# Altium schematic sheet RA-Manager_Relays.SchDoc
size A4
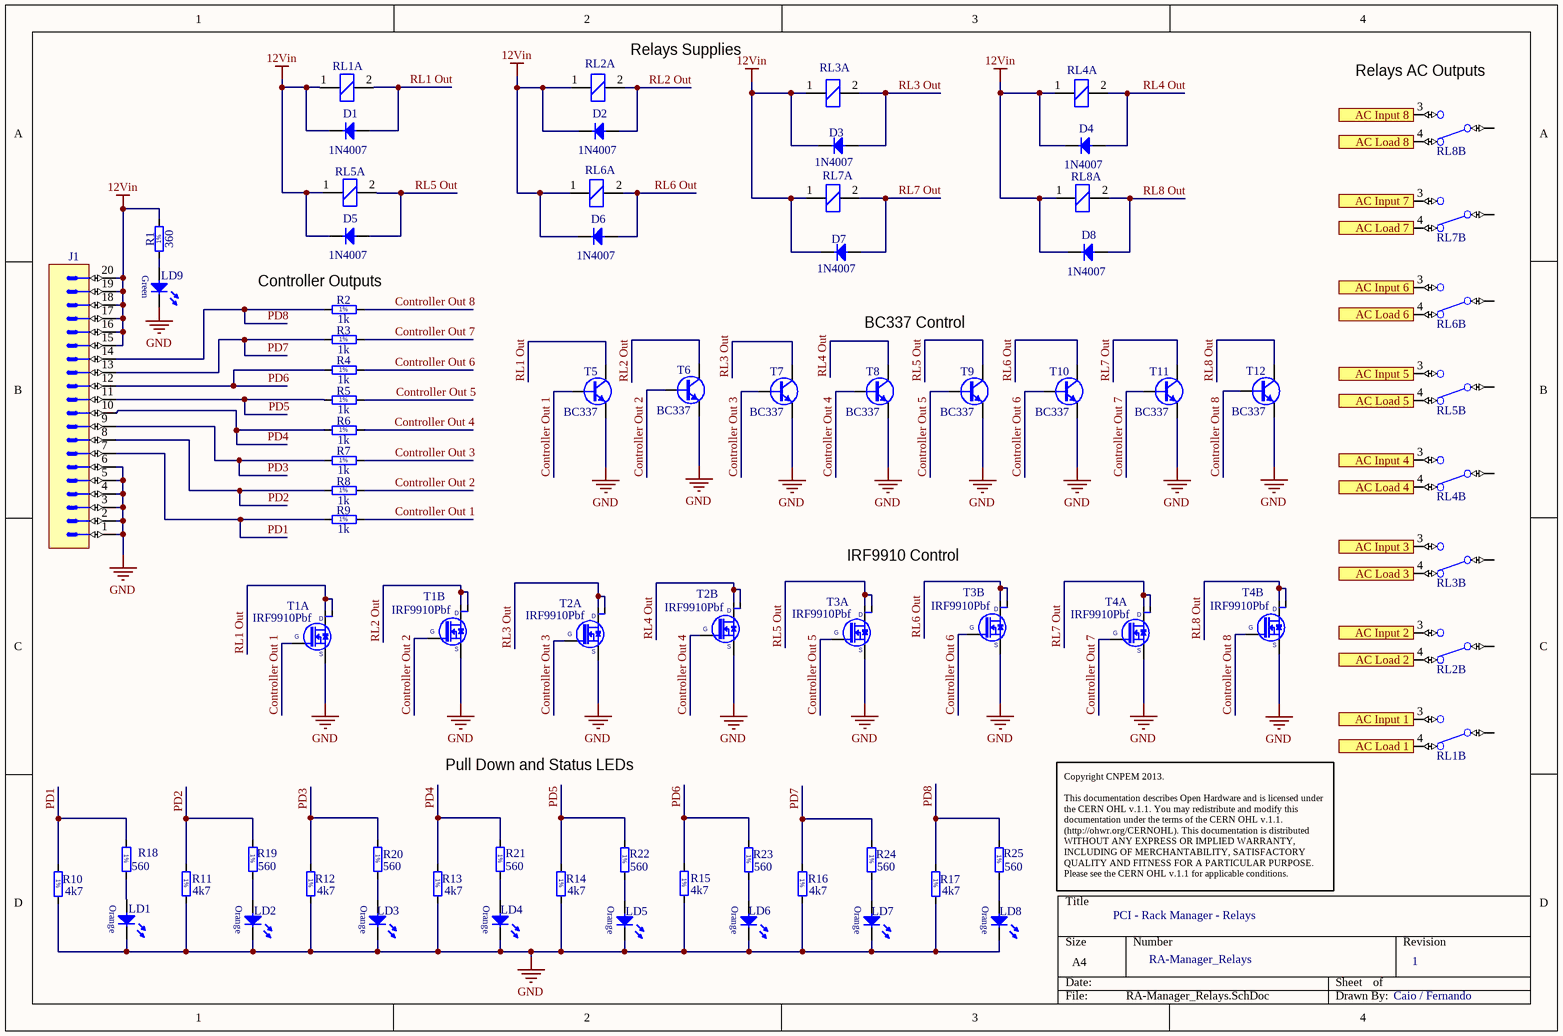
[diagram p0: RA-Manager_Relays.SchDoc]

## Parts
D1  1N4007  [DO-41]
D2  1N4007  [DO-41]
D3  1N4007  [DO-41]
D4  1N4007  [DO-41]
D5  1N4007  [DO-41]
D6  1N4007  [DO-41]
D7  1N4007  [DO-41]
D8  1N4007  [DO-41]
J1  (no value)  [TYCO_2-87224-0]
LD1  Orange  [LED_OSRAM_LGL29K]  (value not drawn)
LD2  Orange  [LED_OSRAM_LGL29K]  (value not drawn)
LD3  Orange  [LED_OSRAM_LGL29K]  (value not drawn)
LD4  Orange  [LED_OSRAM_LGL29K]  (value not drawn)
LD5  Orange  [LED_OSRAM_LGL29K]  (value not drawn)
LD6  Orange  [LED_OSRAM_LGL29K]  (value not drawn)
LD7  Orange  [LED_OSRAM_LGL29K]  (value not drawn)
LD8  Orange  [LED_OSRAM_LGL29K]  (value not drawn)
LD9  Green  [LED_KINGBRIGHT_APA1606_0605]  (value not drawn)
R1  360  [RESC1608X55N]
R2  1k  [RESC1608X55N]
R3  1k  [RESC1608X55N]
R4  1k  [RESC1608X55N]
R5  1k  [RESC1608X55N]
R6  1k  [RESC1608X55N]
R7  1k  [RESC1608X55N]
R8  1k  [RESC1608X55N]
R9  1k  [RESC1608X55N]
R10  4k7  [RESC1608X55N]
R11  4k7  [RESC1608X55N]
R12  4k7  [RESC1608X55N]
R13  4k7  [RESC1608X55N]
R14  4k7  [RESC1608X55N]
R15  4k7  [RESC1608X55N]
R16  4k7  [RESC1608X55N]
R17  4k7  [RESC1608X55N]
R18  560  [RESC1608X55N]
R19  560  [RESC1608X55N]
R20  560  [RESC1608X55N]
R21  560  [RESC1608X55N]
R22  560  [RESC1608X55N]
R23  560  [RESC1608X55N]
R24  560  [RESC1608X55N]
R25  560  [RESC1608X55N]
RL1  12VDC  [REL_YRE_YR-PL2-12]  (value not drawn)  (parts A,B of 2)
RL2  12VDC  [REL_YRE_YR-PL2-12]  (value not drawn)  (parts A,B of 2)
RL3  12VDC  [REL_YRE_YR-PL2-12]  (value not drawn)  (parts A,B of 2)
RL4  12VDC  [REL_YRE_YR-PL2-12]  (value not drawn)  (parts A,B of 2)
RL5  12VDC  [REL_YRE_YR-PL2-12]  (value not drawn)  (parts A,B of 2)
RL6  12VDC  [REL_YRE_YR-PL2-12]  (value not drawn)  (parts A,B of 2)
RL7  12VDC  [REL_YRE_YR-PL2-12]  (value not drawn)  (parts A,B of 2)
RL8  12VDC  [REL_YRE_YR-PL2-12]  (value not drawn)  (parts A,B of 2)
T1  IRF9910Pbf  [SOIC127P600X175-8N]  (parts A,B of 2)
T2  IRF9910Pbf  [SOIC127P600X175-8N]  (parts A,B of 2)
T3  IRF9910Pbf  [SOIC127P600X175-8N]  (parts A,B of 2)
T4  IRF9910Pbf  [SOIC127P600X175-8N]  (parts A,B of 2)
T5  BC337  [TO-92AA-P254]
T6  BC337  [TO-92AA-P254]
T7  BC337  [TO-92AA-P254]
T8  BC337  [TO-92AA-P254]
T9  BC337  [TO-92AA-P254]
T10  BC337  [TO-92AA-P254]
T11  BC337  [TO-92AA-P254]
T12  BC337  [TO-92AA-P254]

## Ports
AC Input 1 (in), AC Input 2 (in), AC Input 3 (in), AC Input 4 (in), AC Input 5 (in), AC Input 6 (in), AC Input 7 (in), AC Input 8 (in), AC Load 1 (out), AC Load 2 (out), AC Load 3 (out), AC Load 4 (out), AC Load 5 (out), AC Load 6 (out), AC Load 7 (out), AC Load 8 (out)

## Nets
12Vin: D1.1(C) D2.1(C) D3.1(C) D4.1(C) D5.1(C) D6.1(C) D7.1(C) D8.1(C) J1.15 J1.16 J1.17 J1.18 J1.19 J1.20 R1.2 RL1.1(COIL) RL2.1(COIL) RL3.1(COIL) RL4.1(COIL) RL5.1(COIL) RL6.1(COIL) RL7.1(COIL) RL8.1(COIL)
GND: J1.1 J1.2 J1.3 J1.4 J1.5 J1.6 LD1.1(C) LD2.1(C) LD3.1(C) LD4.1(C) LD5.1(C) LD6.1(C) LD7.1(C) LD8.1(C) LD9.1(C) R10.2 R11.2 R12.2 R13.2 R14.2 R15.2 R16.2 R17.2 T1.1(S) T1.3(S) T2.1(S) T2.3(S) T3.1(S) T3.3(S) T4.1(S) T4.3(S) T5.3(E) T6.3(E) T7.3(E) T8.3(E) T9.3(E) T10.3(E) T11.3(E) T12.3(E)
AC Input 1: RL1.3(NO) ; port AC Input 1
AC Input 2: RL2.3(NO) ; port AC Input 2
AC Input 3: RL3.3(NO) ; port AC Input 3
AC Input 4: RL4.3(NO) ; port AC Input 4
AC Input 5: RL5.3(NO) ; port AC Input 5
AC Input 6: RL6.3(NO) ; port AC Input 6
AC Input 7: RL7.3(NO) ; port AC Input 7
AC Input 8: RL8.3(NO) ; port AC Input 8
AC Load 1: RL1.4(NC) ; port AC Load 1
AC Load 2: RL2.4(NC) ; port AC Load 2
AC Load 3: RL3.4(NC) ; port AC Load 3
AC Load 4: RL4.4(NC) ; port AC Load 4
AC Load 5: RL5.4(NC) ; port AC Load 5
AC Load 6: RL6.4(NC) ; port AC Load 6
AC Load 7: RL7.4(NC) ; port AC Load 7
AC Load 8: RL8.4(NC) ; port AC Load 8
Controller Out 1: R9.2 T1.4(G) T5.2(B)
Controller Out 2: R8.2 T1.2(G) T6.2(B)
Controller Out 3: R7.2 T2.4(G) T7.2(B)
Controller Out 4: R6.2 T2.2(G) T8.2(B)
Controller Out 5: R5.2 T3.4(G) T9.2(B)
Controller Out 6: R4.2 T3.2(G) T10.2(B)
Controller Out 7: R3.2 T4.4(G) T11.2(B)
Controller Out 8: R2.2 T4.2(G) T12.2(B)
PD1: J1.7 R9.1 R10.1 R18.1
PD2: J1.8 R8.1 R11.1 R19.1
PD3: J1.9 R7.1 R12.1 R20.1
PD4: J1.10 R6.1 R13.1 R21.1
PD5: J1.11 R5.1 R14.1 R22.1
PD6: J1.12 R4.1 R15.1 R23.1
PD7: J1.13 R3.1 R16.1 R24.1
PD8: J1.14 R2.1 R17.1 R25.1
RL1 Out: D1.2(A) RL1.2(COIL) T1.5(D) T1.6(D) T5.1(C)
RL2 Out: D2.2(A) RL2.2(COIL) T1.7(D) T1.8(D) T6.1(C)
RL3 Out: D3.2(A) RL3.2(COIL) T2.5(D) T2.6(D) T7.1(C)
RL4 Out: D4.2(A) RL4.2(COIL) T2.7(D) T2.8(D) T8.1(C)
RL5 Out: D5.2(A) RL5.2(COIL) T3.5(D) T3.6(D) T9.1(C)
RL6 Out: D6.2(A) RL6.2(COIL) T3.7(D) T3.8(D) T10.1(C)
RL7 Out: D7.2(A) RL7.2(COIL) T4.5(D) T4.6(D) T11.1(C)
RL8 Out: D8.2(A) RL8.2(COIL) T4.7(D) T4.8(D) T12.1(C)
NetLD1_2: LD1.2(A) R18.2
NetLD2_2: LD2.2(A) R19.2
NetLD3_2: LD3.2(A) R20.2
NetLD4_2: LD4.2(A) R21.2
NetLD5_2: LD5.2(A) R22.2
NetLD6_2: LD6.2(A) R23.2
NetLD7_2: LD7.2(A) R24.2
NetLD8_2: LD8.2(A) R25.2
NetLD9_2: LD9.2(A) R1.1

Not connected (* = marked no-connect by the designer): RL1 C; RL2 C; RL3 C; RL4 C; RL5 C; RL6 C; RL7 C; RL8 C

## Notes on the sheet
- (near RL2) Relays Supplies
- (near RL8) Relays AC Outputs
- (near R2) Controller Outputs
- BC337 Control
- (near T3) IRF9910 Control
- Pull Down and Status LEDs
- Copyright CNPEM 2013.
  This documentation describes Open Hardware and is licensed under the CERN OHL v.1.1. You may redistribute and modify this documentation under the terms of the CERN OHL v.1.1. (http://ohwr.org/CERNOHL). This documentation is distributed WITHOUT ANY EXPRESS OR IMPLIED WARRANTY, INCLUDING OF MERCHANTABILITY, SATISFACTORY QUALITY AND FITNESS FOR A PARTICULAR PURPOSE. Please see the CERN OHL v.1.1 for applicable conditions.
- PCI - Rack Manager - Relays
- RA-Manager_Relays
- 1
- Caio / Fernando
- (in symbol R0603_1K_1%_0.1W_100PPM) 1%
- (in symbol R0603_4K7_1%_0.1W_100PPM) 1%
- (in symbol R0603_360R_1%_0.1W_100PPM) 1%
- (in symbol R0603_560R_1%_0.1W_100PPM) 1%

## Library data of the parts
D1-D3 D5-D7 = 1N4007: Diode; Part Description: Axial Lead Standard Recovery Rectifier; Manufacturer: FAIRCHILD SEMICONDUCTOR; Voltage: 1000V; Power: 1A; PressFit: No; Bonding: No; Part Number: 1N4007; Component Kind: Standard; Component Type: Standard; Device: 1N4007; PackageDescription: DO-41, Diode, Axial, Body 4.7 x 2.7mm (LxDia. Max), Pin spacing 10.16mm; Manufacturer Part Number: 1N4007; Pin Count: 2; Case: DO-41; Mounted: Yes; Socket: No; SMD: No; Sense: No; ComponentHeight: 2.72mm; HelpURL: \\cern.ch\dfs\Applications\Altium\Datasheets\1N4007.pdf; ComponentLink1URL: \\cern.ch\dfs\Applications\Altium\Datasheets\1N4007_Package.pdf; ComponentLink1Description: Package Drawing; Author: CERN DEM JLC; CreateDate: 20/08/2008; LatestRevisionDate: 30/10/2013
D4 D8 = Diode: Part Description: Axial Lead Standard Recovery Rectifier; Manufacturer: FAIRCHILD SEMICONDUCTOR; Voltage: 1000V; Power: 1A; PressFit: No; Bonding: No; Part Number: 1N4007; Component Kind: Standard; Component Type: Standard; Device: 1N4007; PackageDescription: DO-41, Diode, Axial, Body 4.7 x 2.7mm (LxDia. Max), Pin spacing 10.16mm; Manufacturer Part Number: 1N4007; Pin Count: 2; Case: DO-41; Mounted: Yes; Socket: No; SMD: No; Sense: No; ComponentHeight: 2.72mm; HelpURL: \\cern.ch\dfs\Applications\Altium\Datasheets\1N4007.pdf; ComponentLink1URL: \\cern.ch\dfs\Applications\Altium\Datasheets\1N4007_Package.pdf; ComponentLink1Description: Package Drawing; Author: CERN DEM JLC; CreateDate: 20/08/2008; LatestRevisionDate: 30/10/2013
J1 = TYCO_2-87224-0: Connector 20 Male; Part Description: 20 Contacts, Connector header vertical; Manufacturer: TYCO ELECTRONICS; PressFit: No; Part Number: TYCO_2-87224-0; Component Kind: Standard; Component Type: Standard; Pin Count: 20; Mounted: Yes; Socket: No; SMD: No; Sense: No; Status: None; Manufacturer Part Number: 2-87224-0; ComponentHeight: 13.5mm; Author: LNLS DIG LOS; CreateDate: 16/11/2017; LatestRevisionDate: 16/11/2017
LD1-LD8 = LO L29K-J2L1-24-Z: LED Orange 1C 2A; Part Description: Surface Mount LED (0603 Case); Manufacturer: OSRAM; PressFit: No; Bonding: No; Part Number: LO L29K-J2L1-24-Z; Component Kind: Standard; Component Type: Standard; Color: Orange; PackageDescription: Green Chip LED, 2-Leads, Body 1.7x0.8mm, IPC Medium Density; Manufacturer Part Number: LO L29K-J2L1-24-Z; Pin Count: 2; Case: 0603; Mounted: Yes; Socket: No; SMD: Yes; Sense: No; ComponentHeight: 0.67mm; Author: LNLS DIG LOS; CreateDate: 31/08/2017; LatestRevisionDate: 31/08/2017
LD9 = APA1606ZGC: LED Green 1C 2A; Part Description: SMD Led Right Angle; Manufacturer: KINGBRIGHT; PressFit: No; Bonding: No; Part Number: APA1606ZGC; Component Kind: Standard; Component Type: Standard; Color: Green; PackageDescription: SMD LED, 2-Leads, Body 1.75x0.95mm, 0605, IPC Medium Density; Manufacturer Part Number: APA1606ZGC; Pin Count: 2; Case: 0605; Mounted: Yes; Socket: No; SMD: Yes; Sense: No; ComponentHeight: 1.2mm; Author: LNLS DIG LOS; CreateDate: 31/08/2017; LatestRevisionDate: 31/08/2017
R1 = R0603_360R_1%_0.1W_100PPM: Resistor - 1%; Part Description: General Purpose Thick Film Chip Resistor; Manufacturer: GENERIC; Manufacturer1 Part Number: NRC06F3600TRF; Power: 0.1W; TC: ±100ppm/°C; Part Number: R0603_360R_1%_0.1W_100PPM; Component Kind: Standard; Component Type: Standard; Pin Count: 2; Value: 360; Status: Preferred; Tolerance: ±1%; Manufacturer Part Number: R0603_360R_1%_0.1W_100PPM; Case: 0603; Mounted: Yes; Sense: No; Socket: No; SMD: Yes; Manufacturer1 Example: NIC COMPONENT; Manufacturer1 ComponentHeight: 0.55mm; HelpURL: \\cern.ch\dfs\Applications\Altium\Datasheets\R0603_NIC_NRC.pdf; Author: CERN DEM JLC; CreateDate: 03/12/2007; LatestRevisionDate: 13/03/2008
R2-R9 = R0603_1K_1%_0.1W_100PPM: Resistor - 1%; Part Description: General Purpose Thick Film Chip Resistor; Manufacturer: GENERIC; Manufacturer1 Part Number: NRC06F1001TRF; Power: 0.1W; TC: ±100ppm/°C; Part Number: R0603_1K_1%_0.1W_100PPM; Component Kind: Standard; Component Type: Standard; Pin Count: 2; Value: 1k; Status: Preferred; Tolerance: ±1%; Manufacturer Part Number: R0603_1K_1%_0.1W_100PPM; Case: 0603; Mounted: Yes; Sense: No; Socket: No; SMD: Yes; HelpURL: \\cern.ch\dfs\Applications\Altium\Datasheets\R0603_NIC_NRC.pdf; Author: CERN DEM JLC; CreateDate: 03/12/2007; LatestRevisionDate: 13/03/2008; Manufacturer1 Example: NIC COMPONENT; Manufacturer1 ComponentHeight: 0.55mm
R10-R17 = R0603_4K7_1%_0.1W_100PPM: Resistor - 1%; Part Description: General Purpose Thick Film Chip Resistor; Manufacturer: GENERIC; Manufacturer1 Part Number: NRC06F4701TRF; Power: 0.1W; TC: ±100ppm/°C; Part Number: R0603_4K7_1%_0.1W_100PPM; Component Kind: Standard; Component Type: Standard; Pin Count: 2; Value: 4k7; Status: Preferred; Tolerance: ±1%; Manufacturer Part Number: R0603_4K7_1%_0.1W_100PPM; Case: 0603; Mounted: Yes; Sense: No; Socket: No; SMD: Yes; Manufacturer1 Example: NIC COMPONENT; Manufacturer1 ComponentHeight: 0.55mm; HelpURL: \\cern.ch\dfs\Applications\Altium\Datasheets\R0603_NIC_NRC.pdf; Author: CERN DEM JLC; CreateDate: 03/12/2007; LatestRevisionDate: 13/03/2008
R18-R25 = R0603_560R_1%_0.1W_100PPM: Resistor - 1%; Part Description: General Purpose Thick Film Chip Resistor; Manufacturer: GENERIC; Manufacturer1 Part Number: NRC06F5600TRF; Power: 0.1W; TC: ±100ppm/°C; Part Number: R0603_560R_1%_0.1W_100PPM; Component Kind: Standard; Component Type: Standard; Pin Count: 2; Value: 560; Status: Preferred; Tolerance: ±1%; Manufacturer Part Number: R0603_560R_1%_0.1W_100PPM; Case: 0603; Mounted: Yes; Sense: No; Socket: No; SMD: Yes; Manufacturer1 Example: NIC COMPONENT; Manufacturer1 ComponentHeight: 0.55mm; HelpURL: \\cern.ch\dfs\Applications\Altium\Datasheets\R0603_NIC_NRC.pdf; Author: CERN DEM JLC; CreateDate: 03/12/2007; LatestRevisionDate: 13/03/2008
RL1-RL8 = REL_YRE_YR-PL2-12: Part Description: 16A SPDT Power PCB Relay YR Series; Manufacturer: YRE; PressFit: No; Part Number: REL_YRE_YR-PL2-12; Component Kind: Standard; Component Type: Standard; Pin Count: 4; PackageDescription: 4 Leads, Row Spacing  9,6 mm; Body 30mm x 12mm  YR Serie; Mounted: Yes; Socket: No; SMD: No; Sense: No; Status: None; Value: 12VDC; Manufacturer Part Number: YR-PL2-12; ComponentHeight: 28mm; ComponentLink1URL: https://proesi.com.br/rele-para-refrigerac-o-yr-pl2-12-12v-16a-250vac.html; Author: LNLS DIG CAI; CreateDate: 06/02/2020; LatestRevisionDate: 06/02/2020
T1-T4 = IRF9910Pbf: Dual SO-8 MOSFET For POL Cconverter; Part Description: 20V 10A(Q1) 20V 12A (Q2) Dual SO-8 MOSFET For POL Cconverter; Manufacturer: INTERNATIONAL RECTIFIER; PressFit: No; Bonding: No; Part Number: IRF9910Pbf; Component Kind: Standard; Component Type: Standard; Device: IRF9910Pbf; PackageDescription: SOIC 8, Pitch 1.27mm - Body 4x5mm, IPC Medium Density; Manufacturer Part Number: IRF9910Pbf; Pin Count: 8; Case: DO8; Mounted: Yes; Socket: No; SMD: Yes; Sense: No; ComponentHeight: 1.75mm; HelpURL: \\cern.ch\dfs\Applications\Altium\Datasheets\IRF9910Pbf.pdf; Author: CERN DEM JLC; CreateDate: 30/08/2010; LatestRevisionDate: 30/08/2010
T5-T12 = BC337: NPN Transistor; Part Description: 45V 800mA NPN Small Signal Transistor; Manufacturer: FAIRCHILD SEMICONDUCTOR; PressFit: No; Bonding: No; Part Number: BC337; Component Kind: Standard; Component Type: Standard; Device: BC337; PackageDescription: TO-92 (TO226), Pitch 2.54mm, Flat Index, 3 In-Line, Bent Leads, Body Dia. 5.3mm; Status: Obsolete; Manufacturer Part Number: BC337; Pin Count: 3; Case: TO-92; Mounted: Yes; Socket: No; SMD: No; Sense: No; ComponentHeight: 7.7mm; HelpURL: \\cern.ch\dfs\Applications\Altium\Datasheets\BC337.pdf; Author: CERN DEM JLC; CreateDate: 18/11/2008; LatestRevisionDate: 27/08/2014